# Altium schematic sheet PAGE13.SchDoc
size 246 x 208 mm
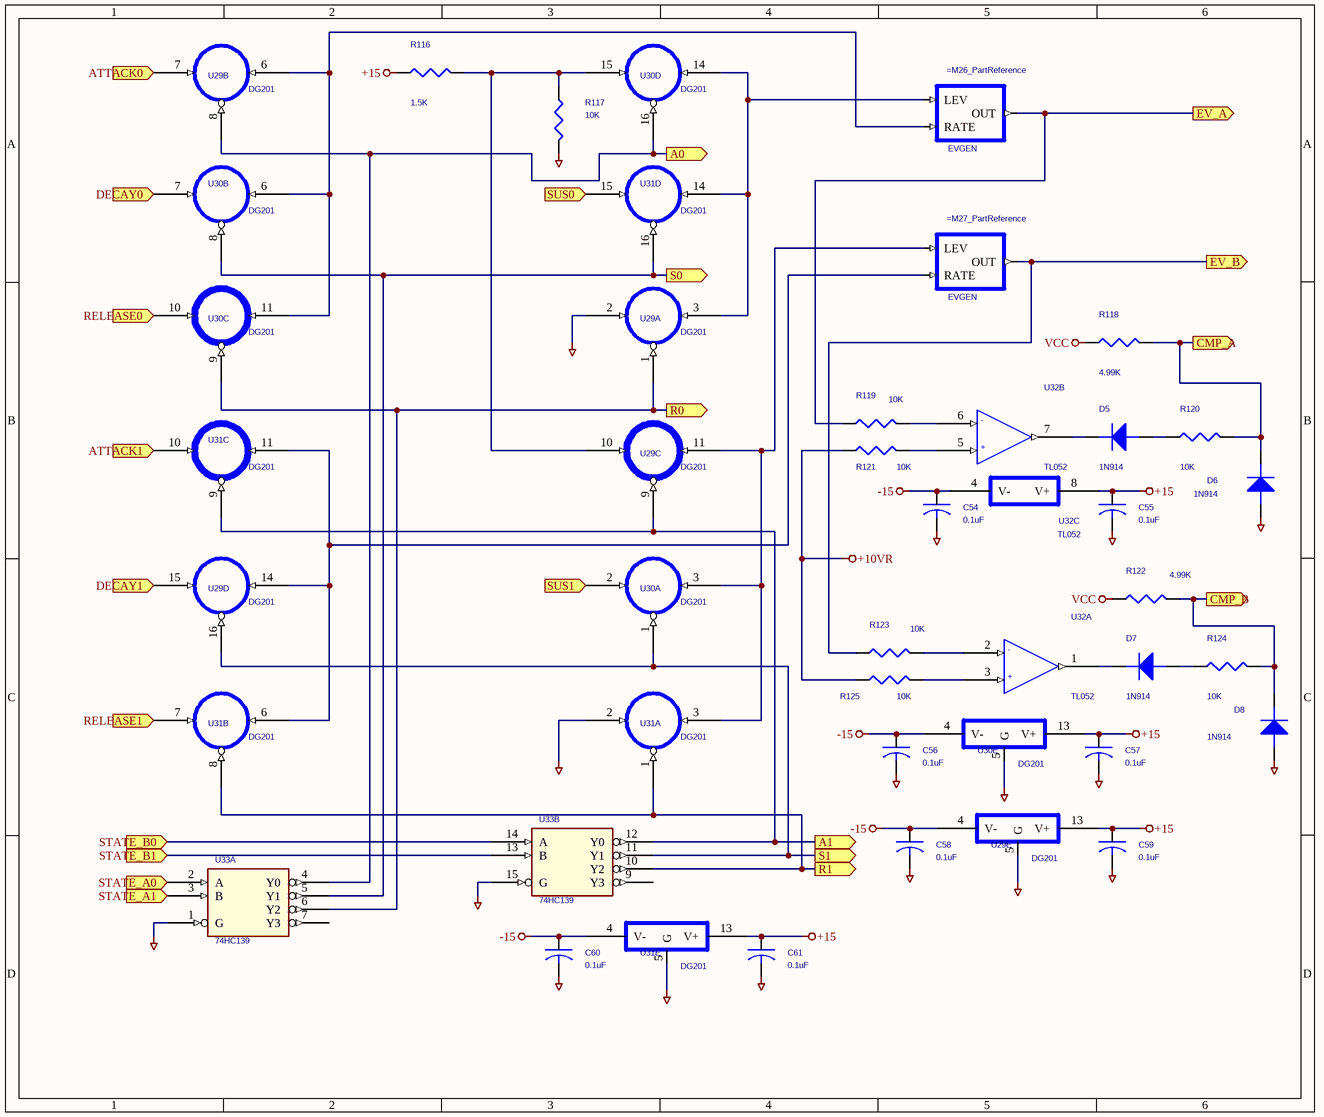
[diagram p0: PAGE13.SchDoc]

## Parts
=M26_PartReference  EVGEN
=M27_PartReference  EVGEN
C54  0.1uF  [AXIALCAP0.3]
C55  0.1uF  [AXIALCAP0.3]
C56  0.1uF  [AXIALCAP0.3]
C57  0.1uF  [AXIALCAP0.3]
C58  0.1uF  [AXIALCAP0.3]
C59  0.1uF  [AXIALCAP0.3]
C60  0.1uF  [AXIALCAP0.3]
C61  0.1uF  [AXIALCAP0.3]
D5  1N914  [DIODE0.4]
D6  1N914  [DIODE0.4]
D7  1N914  [DIODE0.4]
D8  1N914  [DIODE0.4]
R116  1.5K  [AXIAL0.4]
R117  10K  [AXIAL0.4]
R118  4.99K  [AXIAL0.4]
R119  10K  [AXIAL0.4]
R120  10K  [AXIAL0.4]
R121  10K  [AXIAL0.4]
R122  4.99K  [AXIAL0.4]
R123  10K  [AXIAL0.4]
R124  10K  [AXIAL0.4]
R125  10K  [AXIAL0.4]
U29  DG201  [DIP16]  (parts A,B,C,D,E of 5)
U30  DG201  [DIP16]  (parts A,B,C,D,E of 5)
U31  DG201  [DIP16]  (parts A,B,C,D,E of 5)
U32  TL052  [DIP8]  (parts A,B,C of 3)
U33  74HC139  [DIP16]  (parts A,B of 2)

## Ports
A0 (out), A1 (out), ATTACK0 (in), ATTACK1 (in), CMP_A (out), CMP_B (out), DECAY0 (in), DECAY1 (in), EV_A (out), EV_B (out), R0 (out), R1 (out), RELEASE0 (in), RELEASE1 (in), S0 (out), S1 (out), STATE_A0 (in), STATE_A1 (in), STATE_B0 (in), STATE_B1 (in), SUS0 (in), SUS1 (in)

## Nets
+10VR: R121.1 R125.1
+15: C55.1 C57.1 C59.1 C61.1 R116.1 U29.13(V+) U30.13(V+) U31.13(V+) U32.8(V+)
-15: C54.1 C56.1 C58.1 C60.1 U29.4(V-) U30.4(V-) U31.4(V-) U32.4(V-)
AGND: C54.2 C55.2 C56.2 C57.2 C58.2 C59.2 C60.2 C61.2 D6.ANODE D8.ANODE R117.2 U29.2(D) U29.5(G) U30.5(G) U31.2(D) U31.5(G) U33.1(G) U33.15(G)
GND: U33.8(GND)
VCC: R118.1 R122.1 U33.16(VCC)
A0: U29.8(IN) U30.16(IN) U33.4(Y0) ; port A0
A1: U29.9(IN) U31.9(IN) U33.12(Y0) ; port A1
ATTACK0: U29.7(D) ; port ATTACK0
ATTACK1: U31.10(D) ; port ATTACK1
CMP_A: D6.CATHODE R118.2 R120.2 ; port CMP_A
CMP_B: D8.CATHODE R122.2 R124.2 ; port CMP_B
DECAY0: U30.7(D) ; port DECAY0
DECAY1: U29.15(D) ; port DECAY1
EV_A: =M26_PartReference.OUT R119.1 ; port EV_A
EV_B: =M27_PartReference.OUT R123.1 ; port EV_B
R0: U29.1(IN) U30.9(IN) U33.6(Y2) ; port R0
R1: U31.1(IN) U31.8(IN) U33.10(Y2) ; port R1
RELEASE0: U30.10(D) ; port RELEASE0
RELEASE1: U31.7(D) ; port RELEASE1
S0: U30.8(IN) U31.16(IN) U33.5(Y1) ; port S0
S1: U29.16(IN) U30.1(IN) U33.11(Y1) ; port S1
STATE_A0: U33.2(A) ; port STATE_A0
STATE_A1: U33.3(B) ; port STATE_A1
STATE_B0: U33.14(A) ; port STATE_B0
STATE_B1: U33.13(B) ; port STATE_B1
SUS0: U31.15(D) ; port SUS0
SUS1: U30.2(D) ; port SUS1
Net=M26_PartReference_LEV: =M26_PartReference.LEV U29.3(S1) U30.14(S1) U31.14(S1)
Net=M26_PartReference_RATE: =M26_PartReference.RATE U29.6(S1) U30.6(S1) U30.11(S1)
Net=M27_PartReference_LEV: =M27_PartReference.LEV U29.11(S1) U30.3(S1) U31.3(S1)
Net=M27_PartReference_RATE: =M27_PartReference.RATE U29.14(S1) U31.6(S1) U31.11(S1)
NetD5_ANODE: D5.ANODE R120.1
NetD5_CATHODE: D5.CATHODE U32.7(OUT)
NetD7_ANODE: D7.ANODE R124.1
NetD7_CATHODE: D7.CATHODE U32.1(OUT)
NetR116_2: R116.2 R117.1 U29.10(D) U30.15(D)
NetR119_2: R119.2 U32.6(-)
NetR121_2: R121.2 U32.5(+)
NetR123_2: R123.2 U32.2(-)
NetR125_2: R125.2 U32.3(+)

Not connected (* = marked no-connect by the designer): U33 7(Y3) 9(Y3)

## Library data of the parts
C54-C61 = CAP_Dup1
D5-D8 = DIODE
R116-R125 = R_Dup1
U29-U31 = DG201H_Dup1: DIGIKEY PN: ADG201AKNZ-ND
  U29: PACKAGE: EG1
  U30: PACKAGE: EG3
  U31: PACKAGE: EG2
U32 = GEN DUAL OPAMP-H: PACKAGE: EG4
=M26_PartReference =M27_PartReference = EVGEN
  =M26_PartReference: PACKAGE: =M26_PACKAGE; TitleBlock_1_Page_Number: =M26_TitleBlock_1_Page_Number; TitleBlock_1_Title: =M26_TitleBlock_1_Title; Q__11_PartReference: =M26_Q__11_PartReference; Q__8_PartReference: =M26_Q__8_PartReference; C__17_PartReference: =M26_C__17_PartReference; U__17_PartReference: =M26_U__17_PartReference; U__17_PACKAGE: =M26_U__17_PACKAGE; Q__9_PartReference: =M26_Q__9_PartReference; C__18_PartReference: =M26_C__18_PartReference; R__43_PartReference: =M26_R__43_PartReference; C__19_PartReference: =M26_C__19_PartReference; U__12_PartReference: =M26_U__12_PartReference; U__12_PACKAGE: =M26_U__12_PACKAGE; R__44_PartReference: =M26_R__44_PartReference; C__20_PartReference: =M26_C__20_PartReference; R__45_PartReference: =M26_R__45_PartReference; Q__10_PartReference: =M26_Q__10_PartReference; C__15_PartReference: =M26_C__15_PartReference; U__13_PartReference: =M26_U__13_PartReference; U__13_PACKAGE: =M26_U__13_PACKAGE; R__39_PartReference: =M26_R__39_PartReference; U__14_PartReference: =M26_U__14_PartReference; U__14_PACKAGE: =M26_U__14_PACKAGE; C__16_PartReference: =M26_C__16_PartReference; U__15_PartReference: =M26_U__15_PartReference; U__15_PACKAGE: =M26_U__15_PACKAGE; R__40_PartReference: =M26_R__40_PartReference; U__16_PartReference: =M26_U__16_PartReference; U__16_PACKAGE: =M26_U__16_PACKAGE; R__41_PartReference: =M26_R__41_PartReference; R__46_PartReference: =M26_R__46_PartReference; R__42_PartReference: =M26_R__42_PartReference; TitleBlock_7_Page_Number: =M26_TitleBlock_7_Page_Number; TitleBlock_7_Title: =M26_TitleBlock_7_Title
  =M27_PartReference: PACKAGE: =M27_PACKAGE; C__21_PartReference: =M27_C__21_PartReference; TitleBlock_1_Page_Number: =M27_TitleBlock_1_Page_Number; TitleBlock_1_Title: =M27_TitleBlock_1_Title; Q__11_PartReference: =M27_Q__11_PartReference; Q__8_PartReference: =M27_Q__8_PartReference; C__17_PartReference: =M27_C__17_PartReference; U__17_PartReference: =M27_U__17_PartReference; U__17_PACKAGE: =M27_U__17_PACKAGE; Q__9_PartReference: =M27_Q__9_PartReference; C__18_PartReference: =M27_C__18_PartReference; R__43_PartReference: =M27_R__43_PartReference; C__19_PartReference: =M27_C__19_PartReference; U__12_PartReference: =M27_U__12_PartReference; U__12_PACKAGE: =M27_U__12_PACKAGE; R__44_PartReference: =M27_R__44_PartReference; C__20_PartReference: =M27_C__20_PartReference; R__45_PartReference: =M27_R__45_PartReference; Q__10_PartReference: =M27_Q__10_PartReference; C__15_PartReference: =M27_C__15_PartReference; U__13_PartReference: =M27_U__13_PartReference; U__13_PACKAGE: =M27_U__13_PACKAGE; R__39_PartReference: =M27_R__39_PartReference; U__14_PartReference: =M27_U__14_PartReference; U__14_PACKAGE: =M27_U__14_PACKAGE; C__16_PartReference: =M27_C__16_PartReference; U__15_PartReference: =M27_U__15_PartReference; U__15_PACKAGE: =M27_U__15_PACKAGE; R__40_PartReference: =M27_R__40_PartReference; U__16_PartReference: =M27_U__16_PartReference; U__16_PACKAGE: =M27_U__16_PACKAGE; R__41_PartReference: =M27_R__41_PartReference; R__46_PartReference: =M27_R__46_PartReference; R__42_PartReference: =M27_R__42_PartReference; TitleBlock_7_Page_Number: =M27_TitleBlock_7_Page_Number; TitleBlock_7_Title: =M27_TitleBlock_7_Title